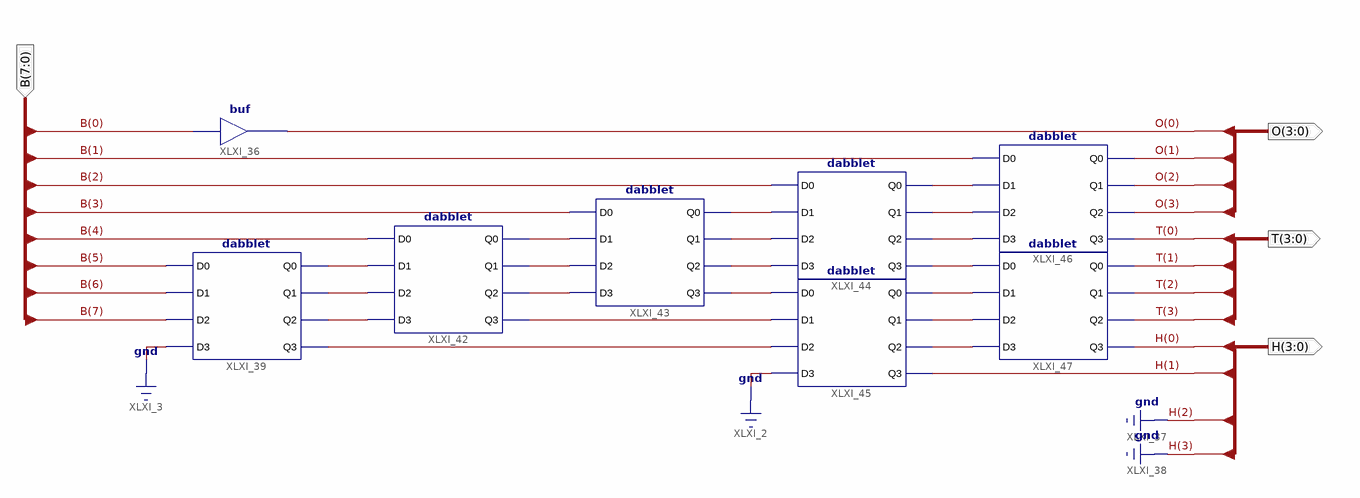
[diagram p0: schematic sheet 1]
// Xilinx ISE schematic dd8tb.sch (spartan6) as structural Verilog: 8 symbols, 4 ports
module dd8tb (
  input  [7:0] B,
  output [3:0] O,
  output [3:0] T,
  output [3:0] H
);

  wire XLXN_2, XLXN_3, XLXN_4, XLXN_5, XLXN_6, XLXN_7, XLXN_10, XLXN_11, XLXN_12, XLXN_13, XLXN_14, XLXN_15,
       XLXN_16, XLXN_17, XLXN_18, XLXN_19, XLXN_20, XLXN_21, XLXN_22;

  buf XLXI_36 (O[0], B[0]);
  dabblet XLXI_39 (.D0(B[5]), .D1(B[6]), .D2(B[7]), .D3(1'b0), .Q0(XLXN_2), .Q1(XLXN_3), .Q2(XLXN_4), .Q3(XLXN_17));
  dabblet XLXI_42 (
    .D0(B[4]), .D1(XLXN_2), .D2(XLXN_3), .D3(XLXN_4), .Q0(XLXN_7), .Q1(XLXN_6), .Q2(XLXN_5), .Q3(XLXN_18));
  dabblet XLXI_43 (
    .D0(B[3]), .D1(XLXN_7), .D2(XLXN_6), .D3(XLXN_5), .Q0(XLXN_22), .Q1(XLXN_21), .Q2(XLXN_20), .Q3(XLXN_19));
  dabblet XLXI_44 (
    .D0(B[2]), .D1(XLXN_22), .D2(XLXN_21), .D3(XLXN_20), .Q0(XLXN_10), .Q1(XLXN_11), .Q2(XLXN_12),
    .Q3(XLXN_13));
  dabblet XLXI_45 (
    .D0(XLXN_19), .D1(XLXN_18), .D2(XLXN_17), .D3(1'b0), .Q0(XLXN_14), .Q1(XLXN_15), .Q2(XLXN_16), .Q3(H[1]));
  dabblet XLXI_46 (.D0(B[1]), .D1(XLXN_10), .D2(XLXN_11), .D3(XLXN_12), .Q0(O[1]), .Q1(O[2]), .Q2(O[3]), .Q3(T[0]));
  dabblet XLXI_47 (.D0(XLXN_13), .D1(XLXN_14), .D2(XLXN_15), .D3(XLXN_16), .Q0(T[1]), .Q1(T[2]), .Q2(T[3]), .Q3(H[0]));

  assign H[3:2] = 2'b00;
endmodule
